# Altium schematic sheet Regulator.SchDoc
size A
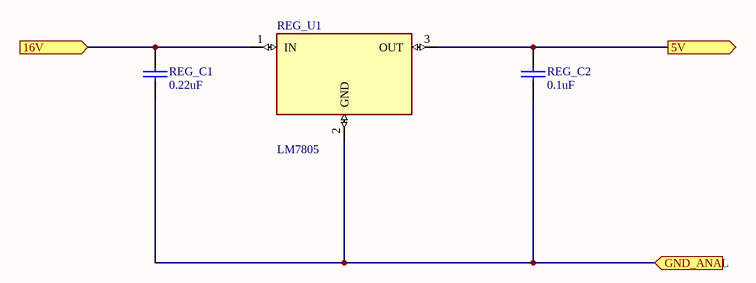
[diagram p0: Regulator.SchDoc]

## Parts
REG_C1  0.22uF  [CAP200]
REG_C2  0.1uF  [CAP200]
REG_U1  LM7805  [TO220]

## Ports
5V (out), 16V (in), GND_ANAL (in)

## Nets
5V: REG_C2.1 REG_U1.3(OUT) ; port 5V
16V: REG_C1.1 REG_U1.1(IN) ; port 16V
GND_ANAL: REG_C1.2 REG_C2.2 REG_U1.2(GND) ; port GND_ANAL

## Library data of the parts
REG_C1 REG_C2 = CAP
REG_U1 = LM7805: Linear Voltage Regulator IC 1 Output 1.5A SOT-223-4; MF: Texas Instruments; Availability: Unavailable; SnapEDA_Link: https://www.snapeda.com/parts/LM7805/Texas%20Instruments/view-part/2302466/?ref=snap; MP: LM7805; Price: None; Value: *; Package: TO-220 Texas Instruments